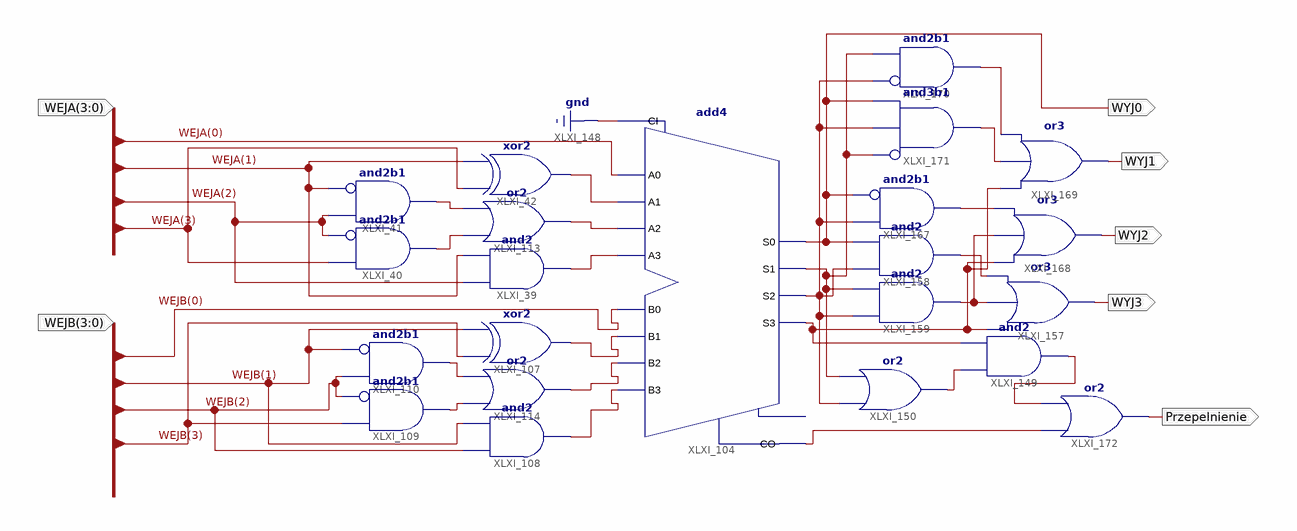
[diagram p0: schematic sheet 1]
// Xilinx ISE schematic aikenAdderScheme.sch (xc9500xl) as structural Verilog: 22 symbols, 7 ports
module aikenAdderScheme (
  input  [3:0] WEJA,
  input  [3:0] WEJB,
  output WYJ0,
  output Przepelnienie,
  output WYJ1,
  output WYJ2,
  output WYJ3
);

  wire XLXN_142, XLXN_143, XLXN_144, XLXN_145, XLXN_157, XLXN_160, XLXN_162, XLXN_164, XLXN_169, XLXN_174,
       XLXN_188, XLXN_189, XLXN_190, XLXN_191, XLXN_192, XLXN_193, XLXN_195, XLXN_196, XLXN_276, XLXN_277,
       XLXN_278;

  add4 XLXI_104 (
    .A0(WEJA[0]), .A1(XLXN_162), .A2(XLXN_160), .A3(XLXN_157), .B0(WEJB[0]), .B1(XLXN_276), .B2(XLXN_277),
    .B3(XLXN_278), .CI(1'b0), .CO(XLXN_195), .S0(WYJ0), .S1(XLXN_169), .S2(XLXN_193), .S3(XLXN_188));  // open: OFL
  or XLXI_113 (XLXN_160, XLXN_143, XLXN_142);
  and XLXI_39 (XLXN_157, WEJA[2], WEJA[1]);
  and XLXI_41 (XLXN_142, ~WEJA[1], WEJA[2]);  // and2b1
  and XLXI_40 (XLXN_143, ~WEJA[2], WEJA[3]);  // and2b1
  xor XLXI_42 (XLXN_162, WEJA[3], WEJA[1]);
  or XLXI_150 (XLXN_164, XLXN_193, XLXN_169);
  and XLXI_149 (XLXN_196, XLXN_164, XLXN_188);
  or XLXI_157 (WYJ3, XLXN_188, XLXN_190, XLXN_174);
  and XLXI_159 (XLXN_190, XLXN_193, XLXN_169);
  and XLXI_158 (XLXN_174, XLXN_193, WYJ0);
  and XLXI_167 (XLXN_189, ~WYJ0, XLXN_193);  // and2b1
  or XLXI_168 (WYJ2, XLXN_188, XLXN_190, XLXN_189);
  or XLXI_169 (WYJ1, XLXN_188, XLXN_191, XLXN_192);
  and XLXI_170 (XLXN_192, ~XLXN_193, XLXN_169);  // and2b1
  and XLXI_171 (XLXN_191, ~XLXN_169, XLXN_193, WYJ0);  // and3b1
  or XLXI_172 (Przepelnienie, XLXN_195, XLXN_196);
  or XLXI_114 (XLXN_277, XLXN_145, XLXN_144);
  xor XLXI_107 (XLXN_276, WEJB[3], WEJB[1]);
  and XLXI_108 (XLXN_278, WEJB[2], WEJB[1]);
  and XLXI_110 (XLXN_144, ~WEJB[1], WEJB[2]);  // and2b1
  and XLXI_109 (XLXN_145, ~WEJB[2], WEJB[3]);  // and2b1
endmodule
